# Altium project STM32f407.PrjPCB
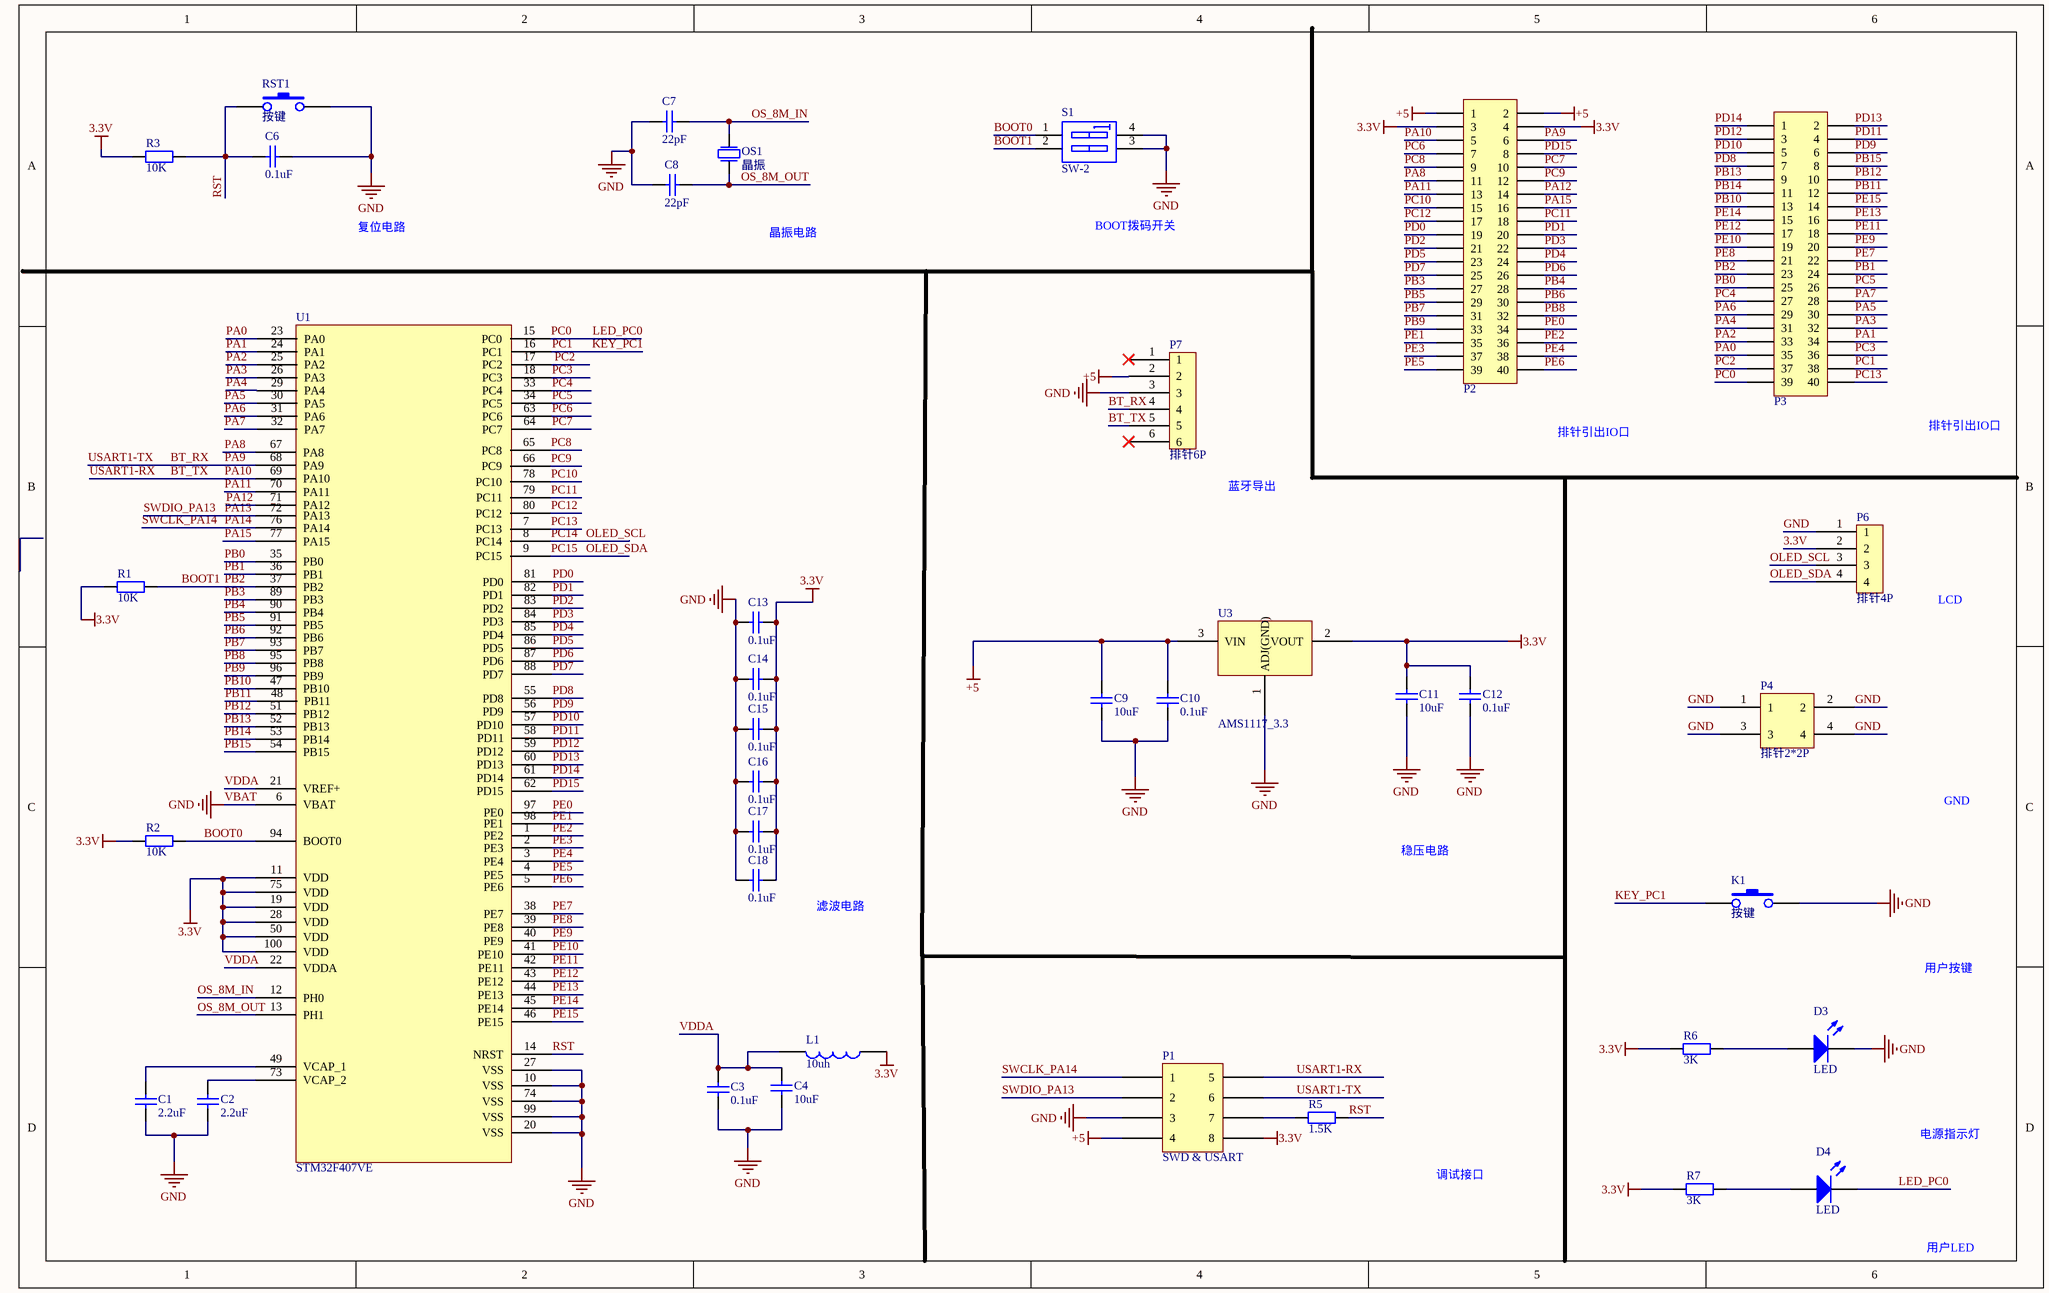
[diagram p0: 原理图.SchDoc]
1 sheet, 38 parts. Net scope: global (net labels, ports and power ports of the same name join across sheets).
Board file: PCB.PcbDoc

## Sheet 原理图.SchDoc
size B

### Parts
C1  2.2uF  [0805_C]
C2  2.2uF  [0805_C]
C3  0.1uF  [0805_C]
C4  10uF  [0805_C]
C6  0.1uF  [0805_C]
C7  22pF  [0805_C]
C8  22pF  [0805_C]
C9  10uF  [0805_C]
C10  0.1uF  [0805_C]
C11  10uF  [0805_C]
C12  0.1uF  [0805_C]
C13  0.1uF  [0805_C]
C14  0.1uF  [0805_C]
C15  0.1uF  [0805_C]
C16  0.1uF  [0805_C]
C17  0.1uF  [0805_C]
C18  0.1uF  [0805_C]
D3  LED  [0805_L]
D4  LED  [0805_L]
K1  按键  [SWT3*4]
L1  10uh  [0805_I]
OS1  晶振  [5032_2P]
P1  SWD & USART  [HDR2X4]
P2  排针2*40P  [HDR2X20]  (value not drawn)
P3  排针2*40P  [HDR2X20]  (value not drawn)
P4  排针2*2P  [HDR2X2]
P6  排针4P  [HDR4]
P7  排针6P  [HDR6]
R1  10K  [0805_R]
R2  10K  [0805_R]
R3  10K  [0805_R]
R5  1.5K  [0805_R]
R6  3K  [0805_R]
R7  3K  [0805_R]
RST1  按键  [SWT3*4]
S1  SW-2  [SWT10*6_P4]
U1  STM32F407VE  [QFP-100_14x14x05P]
U3  AMS1117_3.3  [SOT-223]

### Nets
3.3V: C11.2 C12.1 C13.1 C14.1 C15.1 C16.1 C17.1 C18.1 L1.1 P1.8 P2.3 P2.4 P6.2 R1.1 R2.1 R3.1 R6.1 R7.1 U1.11(VDD) U1.19(VDD) U1.28(VDD) U1.50(VDD) U1.75(VDD) U1.100(VDD) U3.2(VOUT)
+5: C9.1 C10.2 P1.4 P2.1 P2.2 P7.2 U3.3(VIN)
GND: C1.1 C2.1 C3.1 C4.2 C6.2 C7.1 C8.1 C9.2 C10.1 C11.1 C12.2 C13.2 C14.2 C15.2 C16.2 C17.2 C18.2 D3.2(K) K1.2 P1.3 P4.1 P4.2 P4.3 P4.4 P6.1 P7.3 RST1.2 S1.3(B2) S1.4(B1) U1.6(VBAT) U1.10(VSS) U1.20(VSS) U1.27(VSS) U1.74(VSS) U1.99(VSS) U3.1(ADJ(GND))  [also labelled VBAT]
BOOT0: R2.2 S1.1(A1) U1.94(BOOT0)
BOOT1: P3.23 R1.2 S1.2(A2) U1.37(PB2)  [also labelled PB2]
BT_RX: P1.6 P2.6 P7.4 U1.68(PA9)  [also labelled PA9, USART1-TX]
BT_TX: P1.5 P2.5 P7.5 U1.69(PA10)  [also labelled PA10, USART1-RX]
KEY_PC1: K1.1 P3.38 U1.16(PC1)  [also labelled PC1]
LED_PC0: D4.2(K) P3.39 U1.15(PC0)  [also labelled PC0]
OLED_SCL: P6.3 U1.8(PC14)  [also labelled PC14]
OLED_SDA: P6.4 U1.9(PC15)  [also labelled PC15]
OS_8M_IN: C7.2 OS1.1(P1) U1.12(PH0)
OS_8M_OUT: C8.2 OS1.2(P2) U1.13(PH1)
PA0: P3.35 U1.23(PA0)
PA1: P3.34 U1.24(PA1)
PA2: P3.33 U1.25(PA2)
PA3: P3.32 U1.26(PA3)
PA4: P3.31 U1.29(PA4)
PA5: P3.30 U1.30(PA5)
PA6: P3.29 U1.31(PA6)
PA7: P3.28 U1.32(PA7)
PA8: P2.11 U1.67(PA8)
PA11: P2.13 U1.70(PA11)
PA12: P2.14 U1.71(PA12)
PA13: P1.2 U1.72(PA13)  [also labelled SWDIO_PA13]
PA14: P1.1 U1.76(PA14)  [also labelled SWCLK_PA14]
PA15: P2.16 U1.77(PA15)
PB0: P3.25 U1.35(PB0)
PB1: P3.24 U1.36(PB1)
PB3: P2.27 U1.89(PB3)
PB4: P2.28 U1.90(PB4)
PB5: P2.29 U1.91(PB5)
PB6: P2.30 U1.92(PB6)
PB7: P2.31 U1.93(PB7)
PB8: P2.32 U1.95(PB8)
PB9: P2.33 U1.96(PB9)
PB10: P3.13 U1.47(PB10)
PB11: P3.12 U1.48(PB11)
PB12: P3.10 U1.51(PB12)
PB13: P3.9 U1.52(PB13)
PB14: P3.11 U1.53(PB14)
PB15: P3.8 U1.54(PB15)
PC2: P3.37 U1.17(PC2)
PC3: P3.36 U1.18(PC3)
PC4: P3.27 U1.33(PC4)
PC5: P3.26 U1.34(PC5)
PC6: P2.7 U1.63(PC6)
PC7: P2.10 U1.64(PC7)
PC8: P2.9 U1.65(PC8)
PC9: P2.12 U1.66(PC9)
PC10: P2.15 U1.78(PC10)
PC11: P2.18 U1.79(PC11)
PC12: P2.17 U1.80(PC12)
PC13: P3.40 U1.7(PC13)
PD0: P2.19 U1.81(PD0)
PD1: P2.20 U1.82(PD1)
PD2: P2.21 U1.83(PD2)
PD3: P2.22 U1.84(PD3)
PD4: P2.24 U1.85(PD4)
PD5: P2.23 U1.86(PD5)
PD6: P2.26 U1.87(PD6)
PD7: P2.25 U1.88(PD7)
PD8: P3.7 U1.55(PD8)
PD9: P3.6 U1.56(PD9)
PD10: P3.5 U1.57(PD10)
PD11: P3.4 U1.58(PD11)
PD12: P3.3 U1.59(PD12)
PD13: P3.2 U1.60(PD13)
PD14: P3.1 U1.61(PD14)
PD15: P2.8 U1.62(PD15)
PE0: P2.34 U1.97(PE0)
PE1: P2.35 U1.98(PE1)
PE2: P2.36 U1.1(PE2)
PE3: P2.37 U1.2(PE3)
PE4: P2.38 U1.3(PE4)
PE5: P2.39 U1.4(PE5)
PE6: P2.40 U1.5(PE6)
PE7: P3.22 U1.38(PE7)
PE8: P3.21 U1.39(PE8)
PE9: P3.20 U1.40(PE9)
PE10: P3.19 U1.41(PE10)
PE11: P3.18 U1.42(PE11)
PE12: P3.17 U1.43(PE12)
PE13: P3.16 U1.44(PE13)
PE14: P3.15 U1.45(PE14)
PE15: P3.14 U1.46(PE15)
RST: C6.1 R3.2 R5.2 RST1.1 U1.14(NRST)
VDDA: C3.2 C4.1 L1.2 U1.21(VREF+) U1.22(VDDA)
NetC1_2: C1.2 U1.49(VCAP_1)
NetC2_2: C2.2 U1.73(VCAP_2)
NetD3_1: D3.1(A) R6.2
NetD4_1: D4.1(A) R7.2
NetP1_7: P1.7 R5.1

Not connected (* = marked no-connect by the designer): P7 1* 6*

### Notes on the sheet
- 复位电路
- 晶振电路
- BOOT拨码开关
- 排针引出IO口
- 蓝牙导出
- LCD
- GND
- (near C18) 滤波电路
- 稳压电路
- 用户按键
- 调试接口
- 电源指示灯
- 用户LED

### Library data of the parts
C1-C4 C6-C18 = CAP: 电容
L1 = 电感
P1 = CON4-X2
R1-R3 R5-R7 = RES
U1 = STM32F407VE: IC